# Altium project calc.keypad.PrjPcb
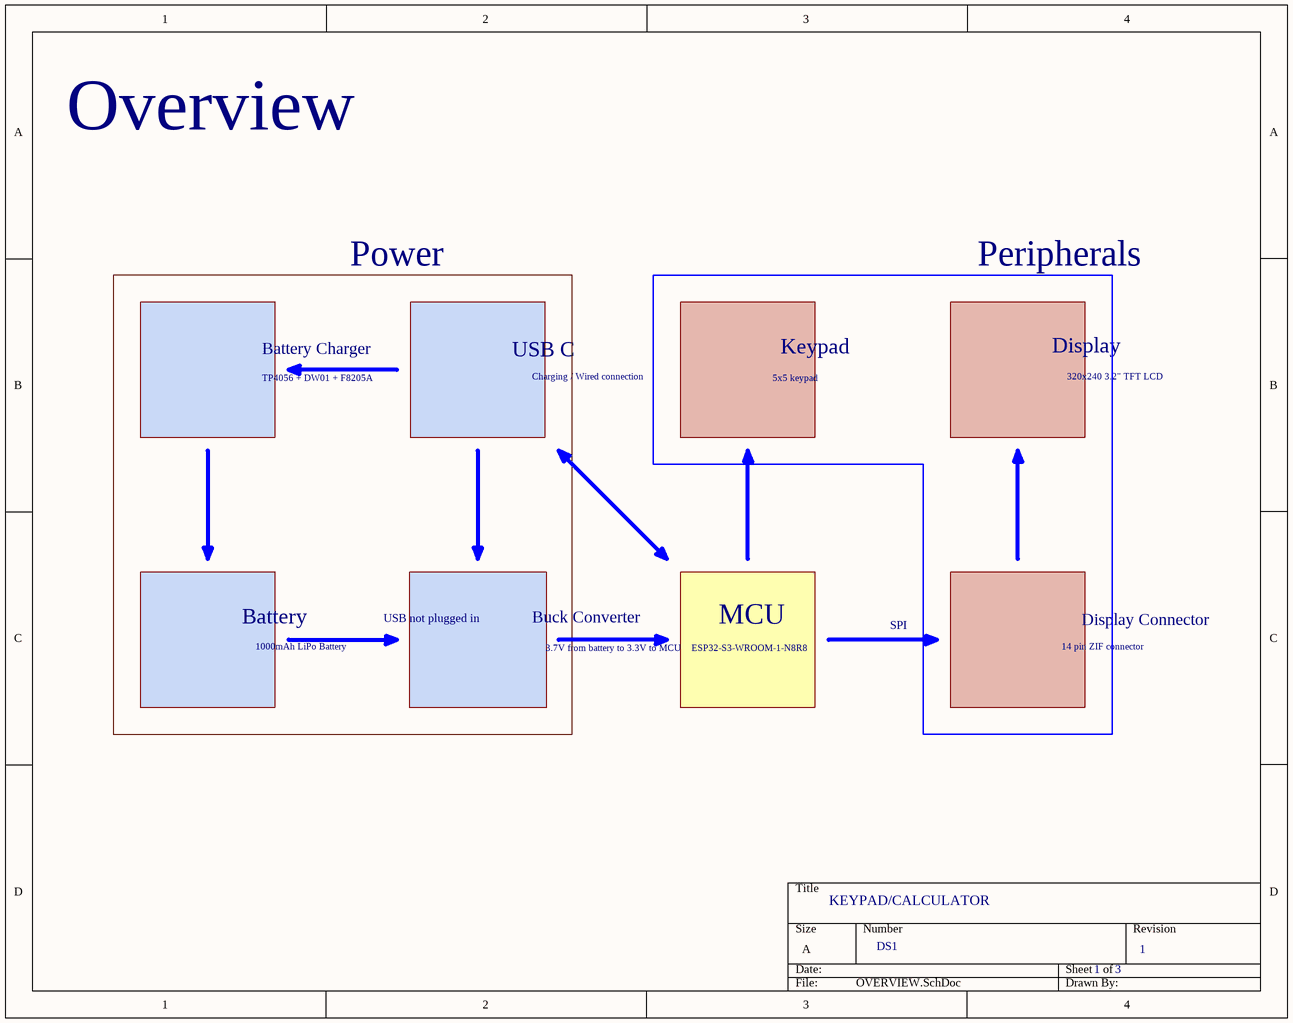
[diagram p0: OVERVIEW.SchDoc]
3 sheets, 101 parts. Net scope: global (net labels, ports and power ports of the same name join across sheets).
Board files: TOPPLATE.PcbDoc, PCB.PcbDoc
Sheets:
  OVERVIEW.SchDoc
  MCU and POWER.SchDoc
  PERIPHERALS.SchDoc

## Sheet OVERVIEW.SchDoc
size A; SheetNumber: 1; SheetTotal: 3

### Notes on the sheet
- Overview
- Power
- Peripherals
- Battery Charger
- USB C
- Keypad
- Display
- TP4056 + DW01 + F8205A
- Charging / Wired connection
- 5x5 keypad
- 320x240 3.2" TFT LCD
- Battery
- USB not plugged in
- Buck Converter
- MCU
- SPI
- Display Connector
- 1000mAh LiPo Battery
- 3.7V from battery to 3.3V to MCU
- ESP32-S3-WROOM-1-N8R8
- 14 pin ZIF connector
- KEYPAD/CALCULATOR
- DS1
- 1     3
- 1

## Sheet MCU and POWER.SchDoc
size 330 x 215 mm; SheetNumber: 2; SheetTotal: 3
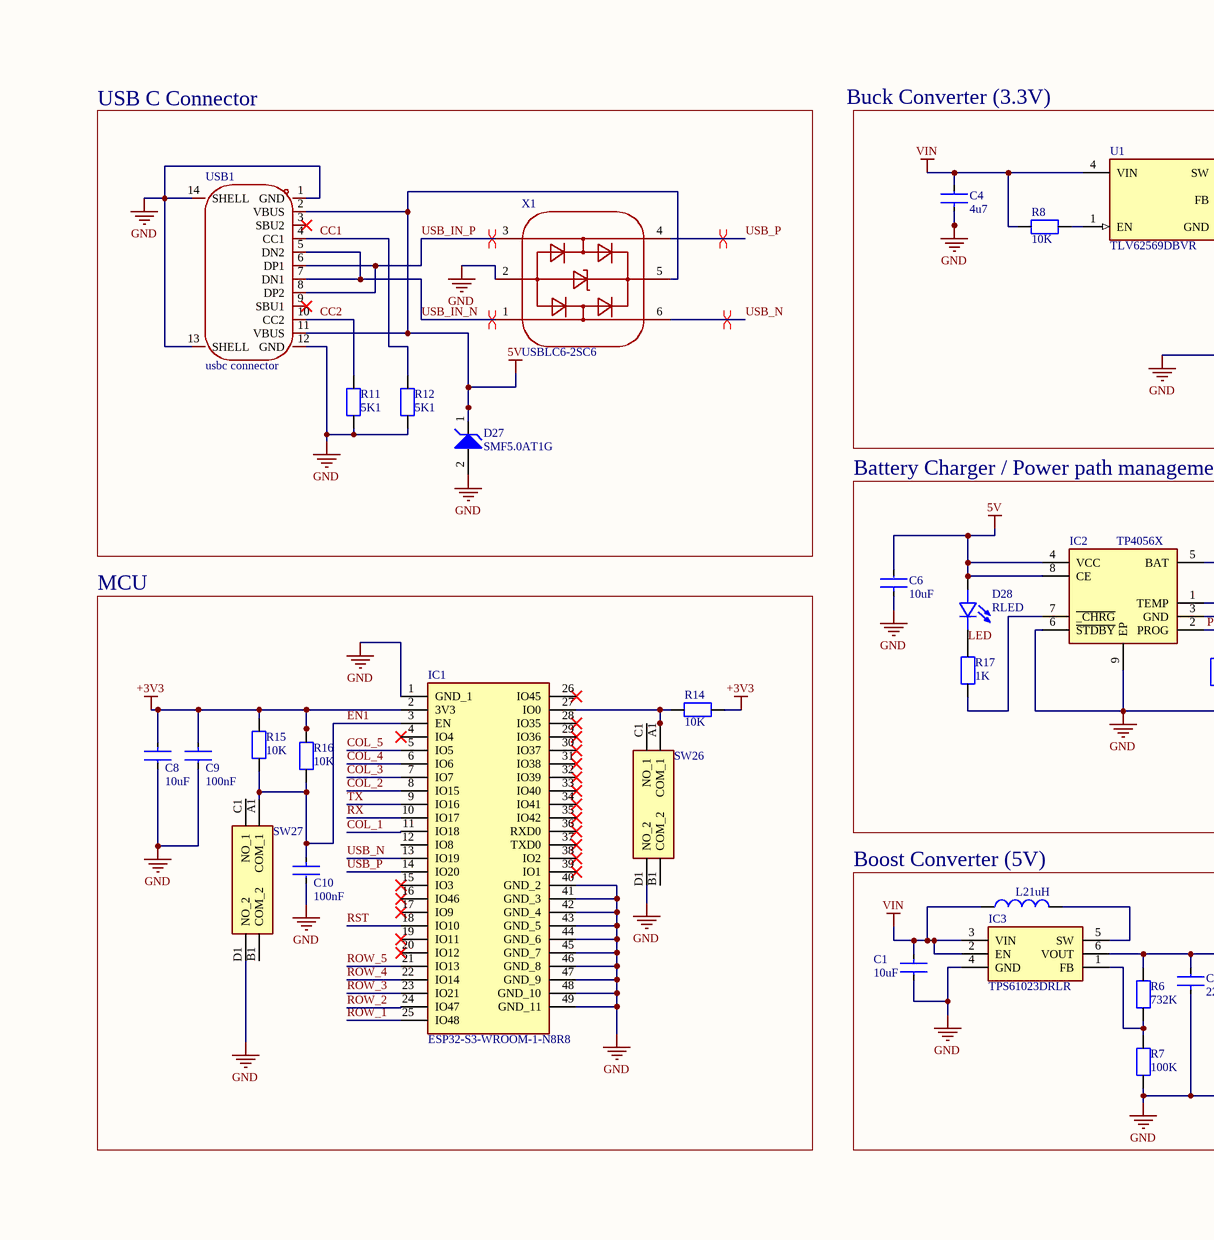
[diagram p1: MCU and POWER.SchDoc, left]
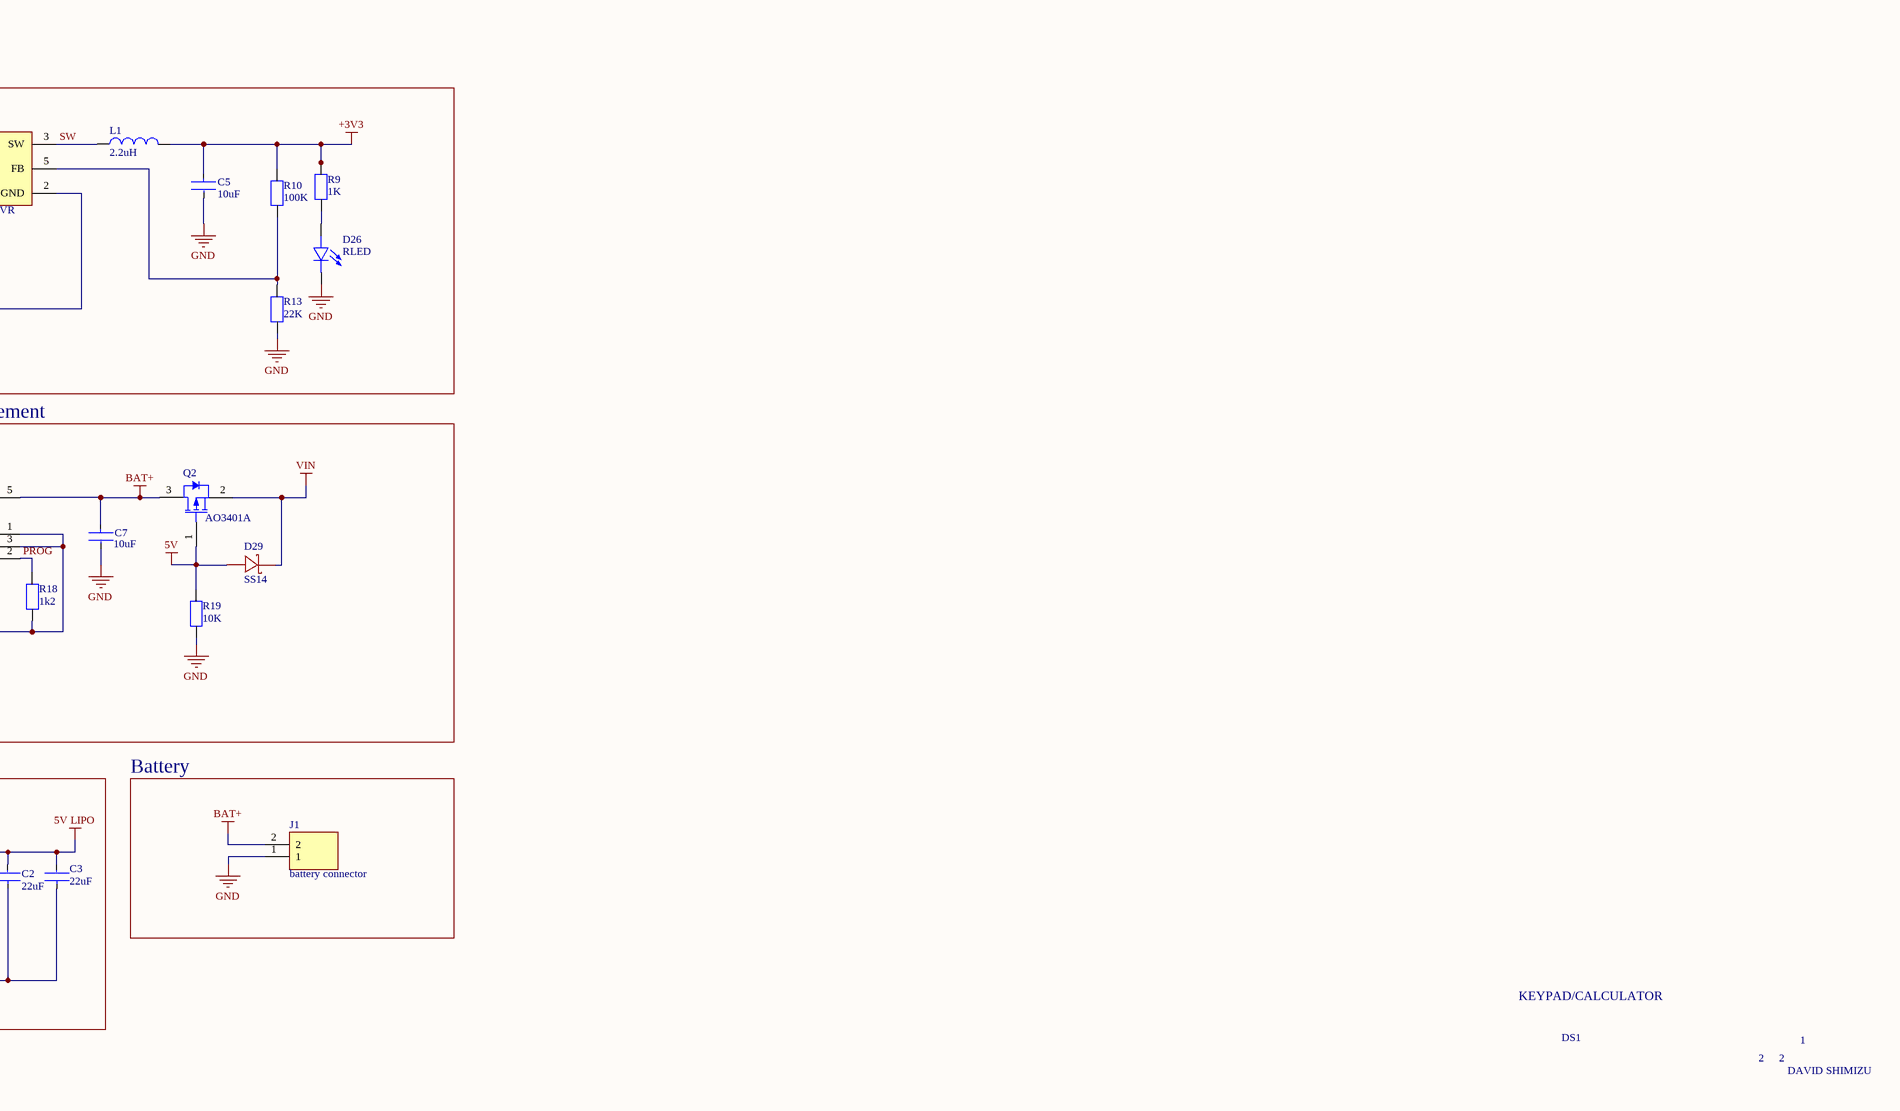
[diagram p2: MCU and POWER.SchDoc, right]

### Parts
C1  10uF  [0402 capacitor]
C2  22uF  [0402 capacitor]
C3  22uF  [0402 capacitor]
C4  4u7  [0402 capacitor]
C5  10uF  [0402 capacitor]
C6  10uF  [0603 CAPACITOR]
C7  10uF  [0603 CAPACITOR]
C8  10uF  [0603 CAPACITOR]
C9  100nF  [0402 capacitor]
C10  100nF  [0402 capacitor]
D26  RLED  [LED_KT-0603R]
D27  SMF5.0AT1G  [ONSC-SOD-123FL-2-498_V]
D28  RLED  [LED_KT-0603R]
D29  SS14  [SMA(DO-214AC)(schottky)]
IC1  ESP32-S3-WROOM-1-N8R8  [ESP32-S3-WROOM-1-N8R8]
IC2  TP4056X  [SOIC127P600X175-9N]
IC3  TPS61023DRLR  [SOTFL50P160X60-6N]
J1  battery connector  [2pin wire to board]
L1  2.2uH  [0603 inductor]
L2  1uH  [0802 inductor]
Q2  AO3401A  [AO-SOT-23-3L_V]
R6  732K  [0402 resistor]
R7  100K  [0402 resistor]
R8  10K  [0603 resistor]
R9  1K  [0402 resistor]
R10  100K  [0603 resistor]
R11  5K1  [0603 resistor]
R12  5K1  [0603 resistor]
R13  22K  [0603 resistor]
R14  10K  [0603 resistor]
R15  10K  [0603 resistor]
R16  10K  [0603 resistor]
R17  1K  [0402 resistor]
R18  1k2  [0603 resistor]
R19  10K  [0603 resistor]
SW26  push button  [push button]  (value not drawn)
SW27  push button  [push button]  (value not drawn)
U1  TLV62569DBVR  [FP-DBV0005A-MFG]
USB1  usbc connector  [USBC connector]
X1  USBLC6-2SC6  [STM-SOT23-6L_V]

### Blocks framed on the sheet
USB C Connector: D27 R11 R12 USB1 X1
Battery Charger / Power path management: C6 C7 D28 D29 IC2 Q2 R17-R19
MCU: C8-C10 IC1 R14-R16 SW26 SW27
Boost Converter (5V): C1-C3 IC3 L2 R6 R7
Battery: J1

### Nets
5V: C6.2 D27.1(K) D28.A D29.2(A) IC2.4(VCC) IC2.8(CE) Q2.1(GATE) R19.2 USB1.2(VBUS) USB1.11(VBUS) X1.5
5V LIPO: C2.2 C3.2 IC3.6(VOUT) R6.2
+3V3: C5.1 C8.1 C9.1 IC1.2(3V3) L1.2 R9.2 R10.2 R14.2 R15.2 R16.2
BAT+: C7.1 IC2.5(BAT) J1.2 Q2.3(DRAIN)
GND: C1.2 C2.1 C3.1 C4.1 C5.2 C6.1 C7.2 C8.2 C9.2 C10.2 D26.C D27.2(A) IC1.1(GND_1) IC1.40(GND_2) IC1.41(GND_3) IC1.42(GND_4) IC1.43(GND_5) IC1.44(GND_6) IC1.45(GND_7) IC1.46(GND_8) IC1.47(GND_9) IC1.48(GND_10) IC1.49(GND_11) IC2.1(TEMP) IC2.3(GND) IC2.6(~{STDBY}) IC2.9(EP) IC3.4(GND) J1.1 R7.1 R11.1 R12.1 R13.1 R18.1 R19.1 SW26.D1(NO_2) SW27.D1(NO_2) U1.2(GND) USB1.1(GND) USB1.12(GND) USB1.13(SHELL) USB1.14(SHELL) X1.2
VIN: C1.1 C4.2 D29.1(K) IC3.2(EN) IC3.3(VIN) L2.1 Q2.2(SOURCE) R8.2 U1.4(VIN)
CC1: R12.2 USB1.4(CC1)
CC2: R11.2 USB1.10(CC2)
COL_1: IC1.11(IO18)
COL_2: IC1.8(IO15)
COL_3: IC1.7(IO7)
COL_4: IC1.6(IO6)
COL_5: IC1.5(IO5)
EN1: C10.1 IC1.3(EN) R15.1 R16.1 SW27.A1(COM_1)
LED: D28.C R17.2
PROG: IC2.2(PROG) R18.2
ROW_1: IC1.25(IO48)
ROW_2: IC1.24(IO47)
ROW_3: IC1.23(IO21)
ROW_4: IC1.22(IO14)
ROW_5: IC1.21(IO13)
RST: IC1.18(IO10)
RX: IC1.10(IO17)
SW: L1.1 U1.3(SW)
TX: IC1.9(IO16)
USB_IN_N: USB1.5(DN2) USB1.7(DN1) X1.1
USB_IN_P: USB1.6(DP1) USB1.8(DP2) X1.3
USB_N: IC1.13(IO19) X1.6
USB_P: IC1.14(IO20) X1.4
NetD26_A: D26.A R9.1
NetIC1_27: IC1.27(IO0) R14.1 SW26.A1(COM_1)
NetIC2_7: IC2.7(~{_CHRG}) R17.1
NetIC3_1: IC3.1(FB) R6.1 R7.2
NetIC3_5: IC3.5(SW) L2.2
NetR8_1: R8.1 U1.1(EN)
NetR10_1: R10.1 R13.2 U1.5(FB)

Not connected (* = marked no-connect by the designer): IC1 4(IO4)* 12(IO8) 15(IO3)* 16(IO46)* 17(IO9)* 19(IO11)* 20(IO12)* 26(IO45)* 28(IO35)* 29(IO36)* 30(IO37)* 31(IO38)* 32(IO39)* 33(IO40)* 34(IO41)* 35(IO42)* 36(RXD0)* 37(TXD0)* 38(IO2)* 39(IO1)*; SW26 B1(COM_2) C1(NO_1); SW27 B1(COM_2) C1(NO_1); USB1 3(SBU2)* 9(SBU1)*

### Layout directives
differential pair: USB_IN_N, USB_IN_P, USB_N, USB_P

### Notes on the sheet
- Buck Converter (3.3V)
- KEYPAD/CALCULATOR
- DS1
- 2     2
- DAVID SHIMIZU
- 1

### Library data of the parts
C1-C5 C9 C10 = 0402 capacitor: 0402 smd capacitor
C6-C8 = 0603 capacitor
D26 D28 = KT-0603R: Red 0603 Light Emitting Diodes; MF: Hubei KENTO Elec; SnapEDA_Link: https://www.snapeda.com/parts/KT-0603R/Hubei+KENTO+Elec/view-part/?ref=snap; Package: Package; Value: *; MP: KT-0603R; Check_prices: https://www.snapeda.com/parts/KT-0603R/Hubei+KENTO+Elec/view-part/?ref=eda
D27 = CMP-1061-00612-1: 200 W Transient Voltage Suppressor, 2-Pin SOD-123FL, Pb-Free, Tape and Reel; Manufacturer: On Semiconductor; Direction: Unidirectional; IR Max (uA): 400; V(BR) Typ (V): 6.7; PackageDescription: 2-Pin SOD, Body 1.65 x 2.7 mm; PartNumber: SMF5.0AT1G; ComponentLink3Description: Package Specification; ComponentLink3URL: http://www.onsemi.com/pub_link/Collateral/498-01.PDF; PackageVersion: Rev. D, 05/2013; Mounting Technology: Surface Mount; PackageReference: SOD-123FL-2-498; ComponentLink2URL: http://www.onsemi.com/pub_link/Collateral/SMF5.0AT1-D.PDF; DatasheetVersion: Rev. 7; ComponentLink1Description: Manufacturer URL; Packing: Tape and Reel; RoHS: Pb-Free; ComponentLink1URL: http://www.onsemi.com/; ComponentLink2Description: Datasheet
D29 = ss14: 40V Independent Type 1A 550mV@1A SMA(DO-214AC) Schottky Diodes ROHS
IC2 = TP4056X: Integrated Circuit; Manufacturer_Name: Nanjing Extension Microelectronics; Datasheet Link: https://datasheet.lcsc.com/szlcsc/Nanjing-Extension-Microelectronics-TP4056X_C191323.pdf; Height: 1.75mm; Manufacturer_Part_Number: TP4056X
IC3 = TPS61023DRLR: Integrated Circuit; Manufacturer_Name: Texas Instruments; Datasheet Link: http://www.ti.com/lit/ds/symlink/tps61023.pdf; Height: 0.6mm; Manufacturer_Part_Number: TPS61023DRLR; Mouser Part Number: 595-TPS61023DRLR; Mouser Price/Stock: https://www.mouser.co.uk/ProductDetail/Texas-Instruments/TPS61023DRLR?qs=BJlw7L4Cy7%2FfEnwYuWeGOg%3D%3D; Arrow Part Number: TPS61023DRLR; Arrow Price/Stock: https://www.arrow.com/en/products/tps61023drlr/texas-instruments?utm_currency=USD&region=nac
J1 = 2pin wire to board
L1 = 0603 inductor
L2 = 0805 inductor
Q2 = CMP-2000-05778-1: P-Channel MOSFET, 30 V, 4 A, -55 to 150 degC, 3-Pin SOT-23-3L, RoHS, Tape and Reel; Manufacturer: Alpha and Omega; Output Power (Max): NotRequiredW; Power Dissipation: 1.4W; Rad Hardened: No; Drain Efficiency: NotRequired%; Drain-Source On-Volt: 30V; Noise Figure: NotRequireddB; Frequency (Max): NotRequiredMHz; Number of  Elements: 1; Gate-Source Voltage (Max): ?12V; Drain Current (Max): 4A; Channel Mode: Enhancement; Drain-Source On-Res: 0.044ohm; Type: PowerMOSFET; Polarity: P; Package URL: http://www.aosmd.com/res/packaging_information/SOT-23-3L.pdf; Datasheet URL: http://www.aosmd.com/res/data_sheets/AO3401A.pdf; Package Type: SOT-23; Package Description: 3-Pin Small Outline Transistor, Body 2.95 x 1.6 mm, Pitch 0.95 mm; Mounting: SurfaceMount; Manufacturer URL: http://www.aosmd.com/; Continuous Drain Current: 4A; Package Reference: SOT-23-3L; Mounting Technology: SurfaceMount; Operating Temperature Classification: Military; Power Gain: NotRequireddB; Datasheet Version: Rev. 3, 03/2011; Operating Temp Range: -55Cto150C; Pin Count: 3
R6 R7 R9 R17 = 0402 resistor
R8 R10-R16 R18 R19 = 0603 resistor
U1 = CMP-04918-000387-1: IC REG BUCK ADJ 2A SOT23-5; Output Configuration: Positive; Min Output Voltage: 600mV; Max Output Voltage: 5.5V; Switching Frequency: 1.5MHz; Output Type: Adjustable; Synchronous Rectifier: Yes; Min Input Voltage: 2.5V; Output Current: 2A; Mount: Surface Mount; Min Operating Temperature: -40°C; Max Operating Temperature: 125°C; RoHS Compliant: Yes; Max Input Voltage: 5.5V; Case/Package: SOT-23-5; Packaging: Cut Tape

## Sheet PERIPHERALS.SchDoc
size A; SheetNumber: 3; SheetTotal: 3
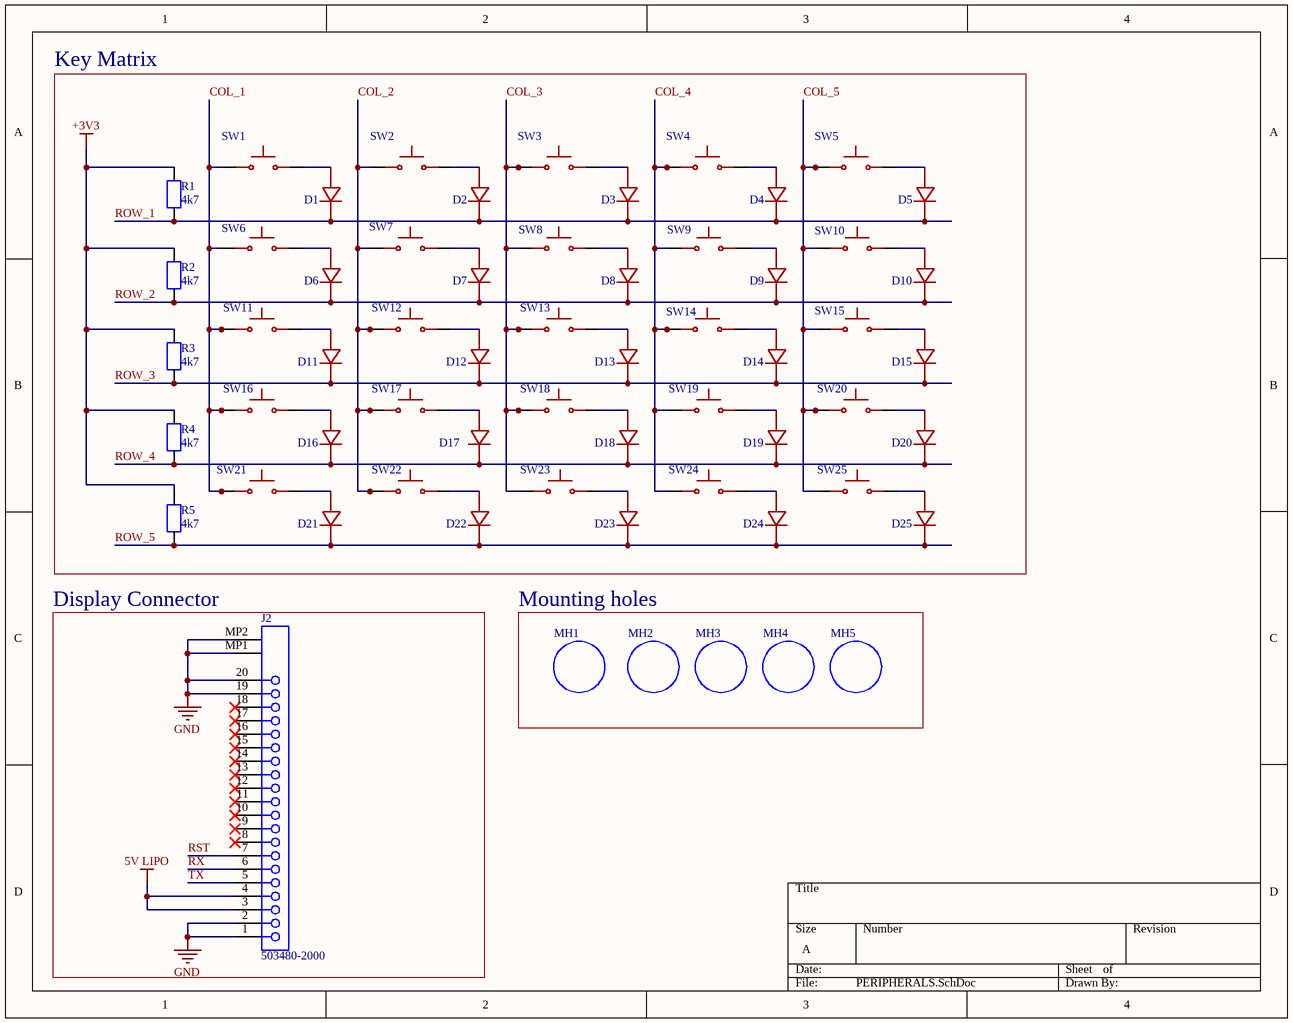
[diagram p3: PERIPHERALS.SchDoc]

### Parts
D1  SOD-323  [SOD-323]  (value not drawn)
D2  SOD-323  [SOD-323]  (value not drawn)
D3  SOD-323  [SOD-323]  (value not drawn)
D4  SOD-323  [SOD-323]  (value not drawn)
D5  SOD-323  [SOD-323]  (value not drawn)
D6  SOD-323  [SOD-323]  (value not drawn)
D7  SOD-323  [SOD-323]  (value not drawn)
D8  SOD-323  [SOD-323]  (value not drawn)
D9  SOD-323  [SOD-323]  (value not drawn)
D10  SOD-323  [SOD-323]  (value not drawn)
D11  SOD-323  [SOD-323]  (value not drawn)
D12  SOD-323  [SOD-323]  (value not drawn)
D13  SOD-323  [SOD-323]  (value not drawn)
D14  SOD-323  [SOD-323]  (value not drawn)
D15  SOD-323  [SOD-323]  (value not drawn)
D16  SOD-323  [SOD-323]  (value not drawn)
D17  SOD-323  [SOD-323]  (value not drawn)
D18  SOD-323  [SOD-323]  (value not drawn)
D19  SOD-323  [SOD-323]  (value not drawn)
D20  SOD-323  [SOD-323]  (value not drawn)
D21  SOD-323  [SOD-323]  (value not drawn)
D22  SOD-323  [SOD-323]  (value not drawn)
D23  SOD-323  [SOD-323]  (value not drawn)
D24  SOD-323  [SOD-323]  (value not drawn)
D25  SOD-323  [SOD-323]  (value not drawn)
J2  503480-2000  [MOLX-503480-2000]
MH1  m2 mounting hole  [m2 mounting hole]  (value not drawn)
MH2  m2 mounting hole  [m2 mounting hole]  (value not drawn)
MH3  m2 mounting hole  [m2 mounting hole]  (value not drawn)
MH4  m2 mounting hole  [m2 mounting hole]  (value not drawn)
MH5  m2 mounting hole  [m2 mounting hole]  (value not drawn)
R1  4k7  [0603 resistor]
R2  4k7  [0603 resistor]
R3  4k7  [0603 resistor]
R4  4k7  [0603 resistor]
R5  4k7  [0603 resistor]
SW1  switch  [chocv1]  (value not drawn)
SW2  switch  [chocv1]  (value not drawn)
SW3  switch  [chocv1]  (value not drawn)
SW4  switch  [chocv1]  (value not drawn)
SW5  switch  [chocv1]  (value not drawn)
SW6  switch  [chocv1]  (value not drawn)
SW7  switch  [chocv1]  (value not drawn)
SW8  switch  [chocv1]  (value not drawn)
SW9  switch  [chocv1]  (value not drawn)
SW10  switch  [chocv1]  (value not drawn)
SW11  switch  [chocv1]  (value not drawn)
SW12  switch  [chocv1]  (value not drawn)
SW13  switch  [chocv1]  (value not drawn)
SW14  switch  [chocv1]  (value not drawn)
SW15  switch  [chocv1]  (value not drawn)
SW16  switch  [chocv1]  (value not drawn)
SW17  switch  [chocv1]  (value not drawn)
SW18  switch  [chocv1]  (value not drawn)
SW19  switch  [chocv1]  (value not drawn)
SW20  switch  [chocv1]  (value not drawn)
SW21  switch  [chocv1]  (value not drawn)
SW22  switch  [chocv1]  (value not drawn)
SW23  switch  [chocv1]  (value not drawn)
SW24  switch  [chocv1]  (value not drawn)
SW25  switch  [chocv1]  (value not drawn)

### Blocks framed on the sheet
Key Matrix: D1-D25 R1-R5 SW1-SW25
Display Connector: J2
Mounting holes: MH1-MH5

### Nets
5V LIPO: J2.3 J2.4
+3V3: R1.2 R2.2 R3.2 R4.2 R5.2
GND: J2.1 J2.2 J2.19 J2.20 J2.MP1 J2.MP2
COL_1: SW1.2 SW6.2 SW11.2 SW16.2 SW21.2
COL_2: SW2.2 SW7.2 SW12.2 SW17.2 SW22.2
COL_3: SW3.2 SW8.2 SW13.2 SW18.2 SW23.2
COL_4: SW4.2 SW9.2 SW14.2 SW19.2 SW24.2
COL_5: SW5.2 SW10.2 SW15.2 SW20.2 SW25.2
ROW_1: D1.1(C) D2.1(C) D3.1(C) D4.1(C) D5.1(C) R1.1
ROW_2: D6.1(C) D7.1(C) D8.1(C) D9.1(C) D10.1(C) R2.1
ROW_3: D11.1(C) D12.1(C) D13.1(C) D14.1(C) D15.1(C) R3.1
ROW_4: D16.1(C) D17.1(C) D18.1(C) D19.1(C) D20.1(C) R4.1
ROW_5: D21.1(C) D22.1(C) D23.1(C) D24.1(C) D25.1(C) R5.1
RST: J2.7
RX: J2.6
TX: J2.5
NetD1_2: D1.2(A) SW1.1
NetD2_2: D2.2(A) SW2.1
NetD3_2: D3.2(A) SW3.1
NetD4_2: D4.2(A) SW4.1
NetD5_2: D5.2(A) SW5.1
NetD6_2: D6.2(A) SW6.1
NetD7_2: D7.2(A) SW7.1
NetD8_2: D8.2(A) SW8.1
NetD9_2: D9.2(A) SW9.1
NetD10_2: D10.2(A) SW10.1
NetD11_2: D11.2(A) SW11.1
NetD12_2: D12.2(A) SW12.1
NetD13_2: D13.2(A) SW13.1
NetD14_2: D14.2(A) SW14.1
NetD15_2: D15.2(A) SW15.1
NetD16_2: D16.2(A) SW16.1
NetD17_2: D17.2(A) SW17.1
NetD18_2: D18.2(A) SW18.1
NetD19_2: D19.2(A) SW19.1
NetD20_2: D20.2(A) SW20.1
NetD21_2: D21.2(A) SW21.1
NetD22_2: D22.2(A) SW22.1
NetD23_2: D23.2(A) SW23.1
NetD24_2: D24.2(A) SW24.1
NetD25_2: D25.2(A) SW25.1

Not connected (* = marked no-connect by the designer): J2 8* 9* 10* 11* 12* 13* 14* 15* 16* 17* 18*

### Library data of the parts
D1-D25 = SOD-323: 1N4148WS
J2 = CMP-1241-00121-1: 0.5 mm Pitch Easy-On(TM) BackFlip(TM) Type FPC Connector, 1.0 mm Mated Height, Right Angle, SMT, Dual Contact, 20 Circuits, -40 to 85 degC, ELV and RoHS Compliant, Tape and Reel; Manufacturer: Molex; Durability (mating cycles max): 10; Material - Plating Mating: Gold; Stackable: No; Voltage (Max): 50V AC (RMS)/DC; Material - Metal: Phosphor Bronze; Entry Angle: 90degrees Angle; Mated Height: 1.00mm; Polarized to PCB: Yes; Pitch - Mating Interface: 0.50mm; Circuits (Loaded): 20; Current (Max per Contact): 0.5A; Material - Plating Termination: Gold, Tin; ComponentLink3Description: Package Specification; ComponentLink1Description: Manufacturer URL; RoHS: TRUE; ComponentLink2Description: Datasheet; Packing: Tape and Reel; ComponentLink2URL: http://www.molex.com/webdocs/datasheets/pdf/en-us/5034802000_FFC_FPC_CONNECTORS.pdf; ComponentLink3URL: http://www.molex.com/pdm_docs/sd/5034802000_sd.pdf; Contact Position: Dual; Mounting Technology: Surface Mount; PackageDescription: 20-Lead FPC Connector, Pitch 0.5 mm; PackageVersion: Rev. F, 09/2012; ComponentLink1URL: http://www.molex.com/molex/index.jsp; PCB Locator: No; PartNumber: 503480-2000; Number of Rows: 1; Orientation: Right Angle; PCB Retention: Yes; PackageReference: 503480-2000
R1-R5 = 0603 resistor

## Nets that join several sheets
5V LIPO: MCU and POWER (C2.2 C3.2 IC3.6 R6.2), PERIPHERALS (J2.3 J2.4)
+3V3: MCU and POWER (10 pins), PERIPHERALS (5 pins)
GND: MCU and POWER (43 pins), PERIPHERALS (6 pins)
COL_1: MCU and POWER (IC1.11), PERIPHERALS (5 pins)
COL_2: MCU and POWER (IC1.8), PERIPHERALS (5 pins)
COL_3: MCU and POWER (IC1.7), PERIPHERALS (5 pins)
COL_4: MCU and POWER (IC1.6), PERIPHERALS (5 pins)
COL_5: MCU and POWER (IC1.5), PERIPHERALS (5 pins)
ROW_1: MCU and POWER (IC1.25), PERIPHERALS (6 pins)
ROW_2: MCU and POWER (IC1.24), PERIPHERALS (6 pins)
ROW_3: MCU and POWER (IC1.23), PERIPHERALS (6 pins)
ROW_4: MCU and POWER (IC1.22), PERIPHERALS (6 pins)
ROW_5: MCU and POWER (IC1.21), PERIPHERALS (6 pins)
RST: MCU and POWER (IC1.18), PERIPHERALS (J2.7)
RX: MCU and POWER (IC1.10), PERIPHERALS (J2.6)
TX: MCU and POWER (IC1.9), PERIPHERALS (J2.5)